# Altium project IBUS_BT_1.01.PrjPcb
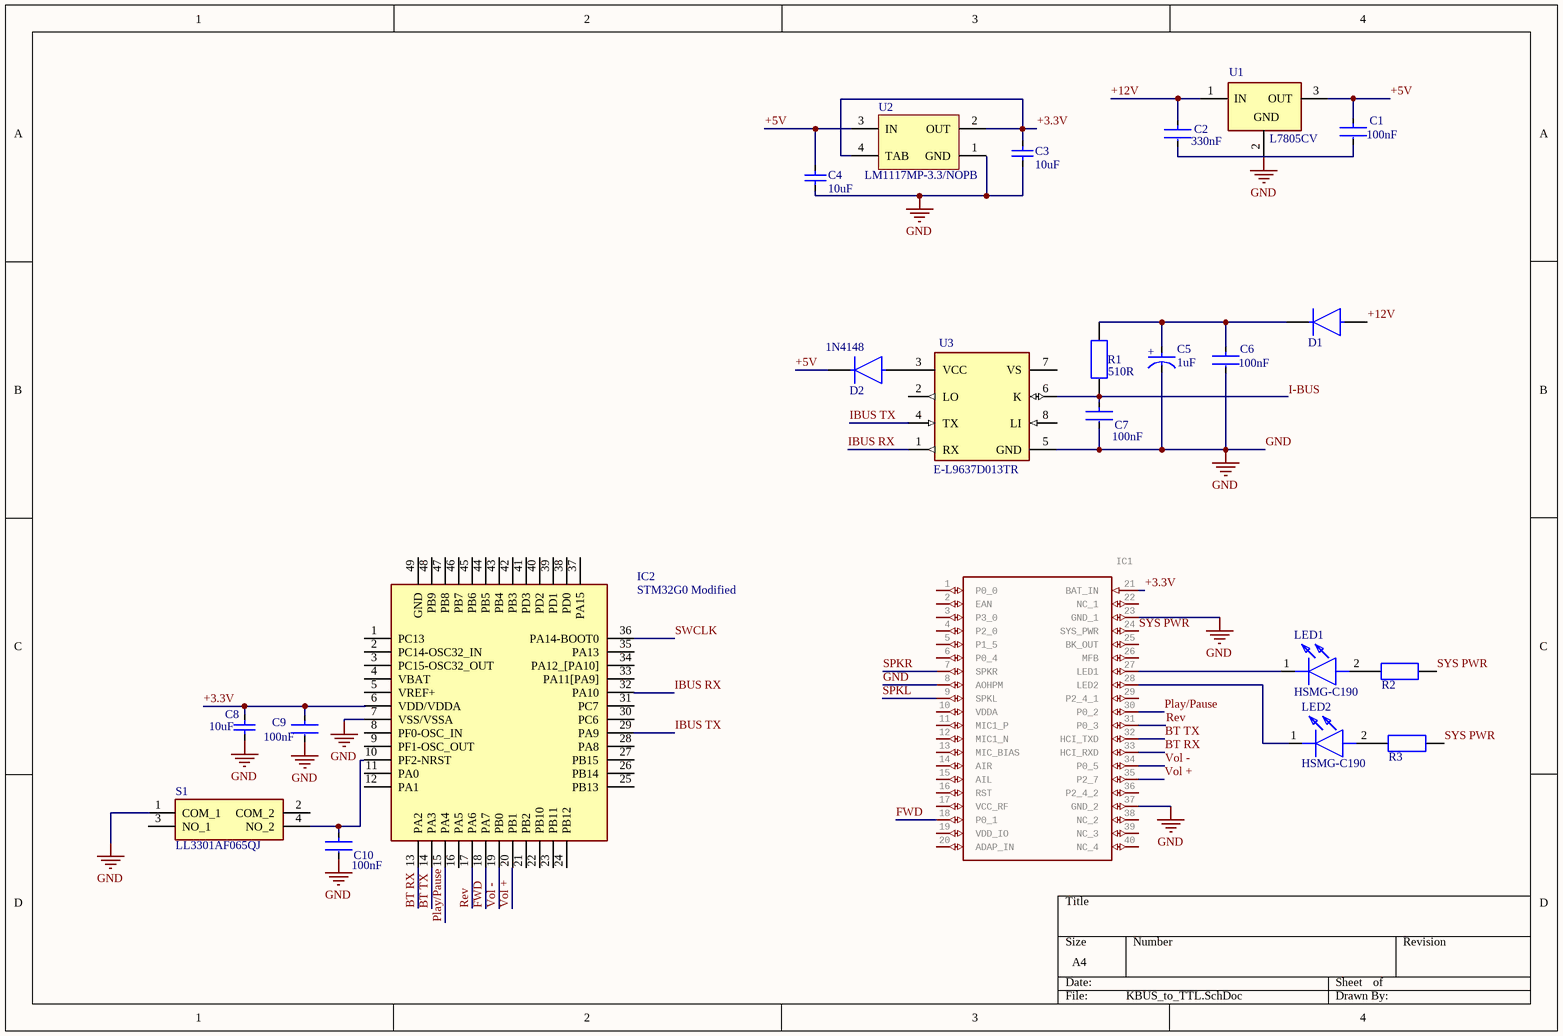
[diagram p0: KBUS_to_TTL.SchDoc]
1 sheet, 23 parts. Net scope: global (net labels, ports and power ports of the same name join across sheets).

## Sheet KBUS_to_TTL.SchDoc
size A4

### Parts
C1  100nF  [KEMET_C1206C-EB_IPC_B]
C2  330nF  [KEMET_C1206C-EB_IPC_B]
C3  10uF  [CAPC1608N]
C4  10uF  [CAPC1608N]
C5  1uF  [Panasonic_SB_MFG]
C6  100nF  [KEMET_C1206C-EB_IPC_B]
C7  100nF  [KEMET_C1206C-EB_IPC_B]
C8  10uF  [CAPC1608N]
C9  100nF  [KEMET_C1206C-EB_IPC_B]
C10  100nF  [KEMET_C1206C-EB_IPC_B]
D1  1N4148WSF-7  [Diodes_Inc._SOD323F_MFG]  (value not drawn)
D2  1N4148  [Diodes_Inc._SOD323F_MFG]
IC1  Bluetooth Modules (802.15.1) BT 4.1 Stereo Audio No-Shield/Antenna   Source:  Datasheet  [BM20SPKA1NBC0001AA]  (value not drawn)
IC2  STM32G0 Modified  [QFN50P700X700X60-49N-D]
LED1  HSMG-C190  [LEDC1608X90N]
LED2  HSMG-C190  [LEDC1608X90N]
R1  510R  [Vishay_CRCW1206-e3_IPC_B]
R2  CRCW1206510RJNEA  [Vishay_CRCW1206-e3_IPC_B]  (value not drawn)
R3  CRCW1206510RJNEA  [Vishay_CRCW1206-e3_IPC_B]  (value not drawn)
S1  LL3301AF065QJ  [LL3301FF065QJ]
U1  L7805CV  [STMicroelectronics_TO-220-3_0]
U2  LM1117MP-3.3/NOPB  [MP04A_N]
U3  E-L9637D013TR  [STMicroelectronics_SO8-0016023_IPC_A]

### Nets
GND: C1.2 C2.2 C3.2 C4.2 C5.1(C) C6.2 C7.2 C8.2 C9.2 C10.2 IC1.8(AOHPM) IC1.23(GND_1) IC1.37(GND_2) IC2.7(VSS/VSSA) S1.1(COM_1) U1.2(GROUND) U3.5(GND)
+3.3V: C3.1 C8.1 C9.1 IC1.21(BAT_IN) IC2.6(VDD/VDDA) U2.2(OUT) U2.4(TAB)
+5V: C1.1 C4.1 D2.1(C) U1.3(OUT) U2.3(IN)
+12V: C2.1 D1.2(A) U1.1(IN)
BT RX: IC1.33(HCI_RXD) IC2.13(PA2)
BT TX: IC1.32(HCI_TXD) IC2.14(PA3)
FWD: IC1.18(P0_1) IC2.18(PA7)
IBUS RX: IC2.32(PA10) U3.1(RX)
IBUS TX: IC2.29(PA9) U3.4(TX)
Play/Pause: IC1.30(P0_2) IC2.15(PA4)
Rev: IC1.31(P0_3) IC2.17(PA6)
SPKL: IC1.9(SPKL)
SPKR: IC1.7(SPKR)
SWCLK: IC2.36(PA14-BOOT0)
SYS PWR: IC1.24(SYS_PWR) R2.2 R3.2
Vol +: IC1.35(P2_7) IC2.20(PB1)
Vol -: IC1.34(P0_5) IC2.19(PB0)
NetC5_2: C5.2(A) C6.1 D1.1(C) R1.2
NetC7_1: C7.1 R1.1 U3.6(K)
NetC10_1: C10.1 IC2.10(PF2-NRST) S1.4(NO_2)
NetD2_2: D2.2(A) U3.3(VCC)
NetIC1_27: IC1.27(LED1) LED1.1(K)
NetIC1_28: IC1.28(LED2) LED2.1(K)
NetLED1_2: LED1.2(A) R2.1
NetLED2_2: LED2.2(A) R3.1

Not connected (* = marked no-connect by the designer): IC1 1(P0_0) 2(EAN) 3(P3_0) 4(P2_0) 5(P1_5) 6(P0_4) 10(VDDA) 11(MIC1_P) 12(MIC1_N) 13(MIC_BIAS) 14(AIR) 15(AIL) 16(RST) 17(VCC_RF) 19(VDD_IO) 20(ADAP_IN) 22(NC_1) 25(BK_OUT) 26(MFB) 29(P2_4_1) 36(P2_4_2) 38(NC_2) 39(NC_3) 40(NC_4); IC2 1(PC13) 2(PC14-OSC32_IN) 3(PC15-OSC32_OUT) 4(VBAT) 5(VREF+) 8(PF0-OSC_IN) 9(PF1-OSC_OUT) 11(PA0) 12(PA1) 16(PA5) 21(PB2) 22(PB10) 23(PB11) 24(PB12) 25(PB13) 26(PB14) 27(PB15) 28(PA8) 30(PC6) 31(PC7) 33(PA11[PA9]) 34(PA12_[PA10]) 35(PA13) 37(PA15) 38(PD0) 39(PD1) 40(PD2) 41(PD3) 42(PB3) 43(PB4) 44(PB5) 45(PB6) 46(PB7) 47(PB8) 48(PB9) 49(GND); S1 2(COM_2) 3(NO_1); U2 1(GND); U3 2(LO) 7(VS) 8(LI)

### Notes on the sheet
- Labels drawn without touching a wire or pin: I-BUS
- (in symbol EEE1HA010SR) +
- (in symbol L7805CV) GND

### Library data of the parts
C1 C2 C6 C7 C9 C10 = C1206C104M5RACTU: Kemet C1206, 100nF, 50VDC, X7R
C3 C4 C8 = GRM188R61C106KAALD: CAP MLCC, 10uF, 16V, 0603 [1608 Metric], ±10%, X5R; Manufacturer: MURATA; Value: 10uF; Package: 0603 [1608 Metric]; Manufacturer Part Number: GRM188R61C106KAALD; Supplier 1: Farnell; Supplier Part Number 1: 2611923; ComponentLink1Description: Datasheet; ComponentLink1URL: https://4donline.ihs.com/images/VipMasterIC/IC/MURE/MURE-S-A0004349797/MURE-S-A0004352506-1.pdf?hkey=6D3A4C79FDBF58556ACFDE234799DDF0; Voltage: 16V; Tolerance: ± 10%; Dielectric: X5R; Mounting: SMD; Part Type: MLCC
C5 = EEE1HA010SR: 1uF electrolytic capacitor
D2 = 1N4148WSF-7
IC1 = BM20SPKA1NBC-0001AA: Manufacturer_Name: Microchip; GateName_1: G$1; SymbolName_1: BM20SPKA1NBC-0001AA; LibraryName: BM20SPKA1NBC-0001AA; DeviceSetName: BM20SPKA1NBC-0001AA; Package: BM20SPKA1NBC0001AA; Manufacturer_Part_Number: BM20SPKA1NBC-0001AA; Mouser_Part_Number: 579-SPKA1NBC-0001AA; Mouser_Price-Stock: https://www.mouser.co.uk/ProductDetail/Microchip-Technology/BM20SPKA1NBC-0001AA?qs=uus7iwvxYD8HqvnWsd76VQ%3D%3D; Arrow_Part_Number: BM20SPKA1NBC-0001AA; Arrow_Price-Stock: https://www.arrow.com/en/products/bm20spka1nbc-0001aa/microchip-technology; Height: 2.5mm
IC2 = STM32G0 Modified: Integrated Circuit; Manufacturer_Name: STMicroelectronics; Manufacturer_Part_Number: STM32G071CBU6; Datasheet Link: https://www.st.com/resource/en/datasheet/stm32g071cb.pdf; Height: 0.6mm; Mouser Part Number: 511-STM32G071CBU6; Mouser Price/Stock: https://www.mouser.co.uk/ProductDetail/STMicroelectronics/STM32G071CBU6?qs=PqoDHHvF648BGloVMMKm2g%3D%3D; Arrow Part Number: STM32G071CBU6; Arrow Price/Stock: https://www.arrow.com/en/products/stm32g071cbu6/stmicroelectronics
LED1 LED2 = HSMG-C190: LED; Manufacturer_Name: Avago Technologies; Datasheet Link: https://datasheet.datasheetarchive.com/originals/distributors/SFDatasheet-4/sf-00083853.pdf; Height: 0.9mm; Mouser2 Part Number: 630-HSMG-C190; Mouser2 Price/Stock: https://www.mouser.com/Search/Refine.aspx?Keyword=630-HSMG-C190; Manufacturer_Part_Number: HSMG-C190
R1-R3 = CRCW1206510RJNEA: Resistor 1206, 510ohm, 5%, 1/4W
S1 = LL3301AF065QJ: Switch; Manufacturer_Name: E-Switch; Datasheet Link: https://media.digikey.com/pdf/Data%20Sheets/E-Switch%20PDFs/LL3301AF065QJ.pdf; Height: 7.3mm; Manufacturer_Part_Number: LL3301AF065QJ
U2 = LM1117MP-3.3/NOPB: 800mA Low-Dropout Linear Regulator, 4-pin SOT-223, Pb-Free; Manufacturer: National Semiconductor; PackageTopMarking: XYTT*N05A; CompType: LDO IC; PowerWise: N; ComponentLink1Description: LM1117 Datasheet; ComponentLink2Description: LM1117 Web Page; DatasheetVersion: Apr-2006; ComponentLink3URL: http://www.national.com/packaging/folders/mp04a.html; ComponentLink1URL: http://www.national.com/ds/LM/LM1117.pdf; ComponentLink2URL: http://www.national.com/pf/LM/LM1117.html; Code_JEDEC: TO-261-AA; RevisionNote: Component URLs added; Code_IPC: SOT223-4; ComponentLink3Description: MP04A Package Page; PackageVersion: revB, Apr-2003; PackageDescription: Molded SOT-223, 6.50 x 3.56 x 1.6mm Body, 4 Lead, 2.3mm Pitch; PinCount: 4; RoHS: Y; PackageReference: MP04A; PartNumber: LM1117MP-3.3/NOPB